# EAGLE schematic whare hauora sensor r1 (EAGLE 7.6.0)
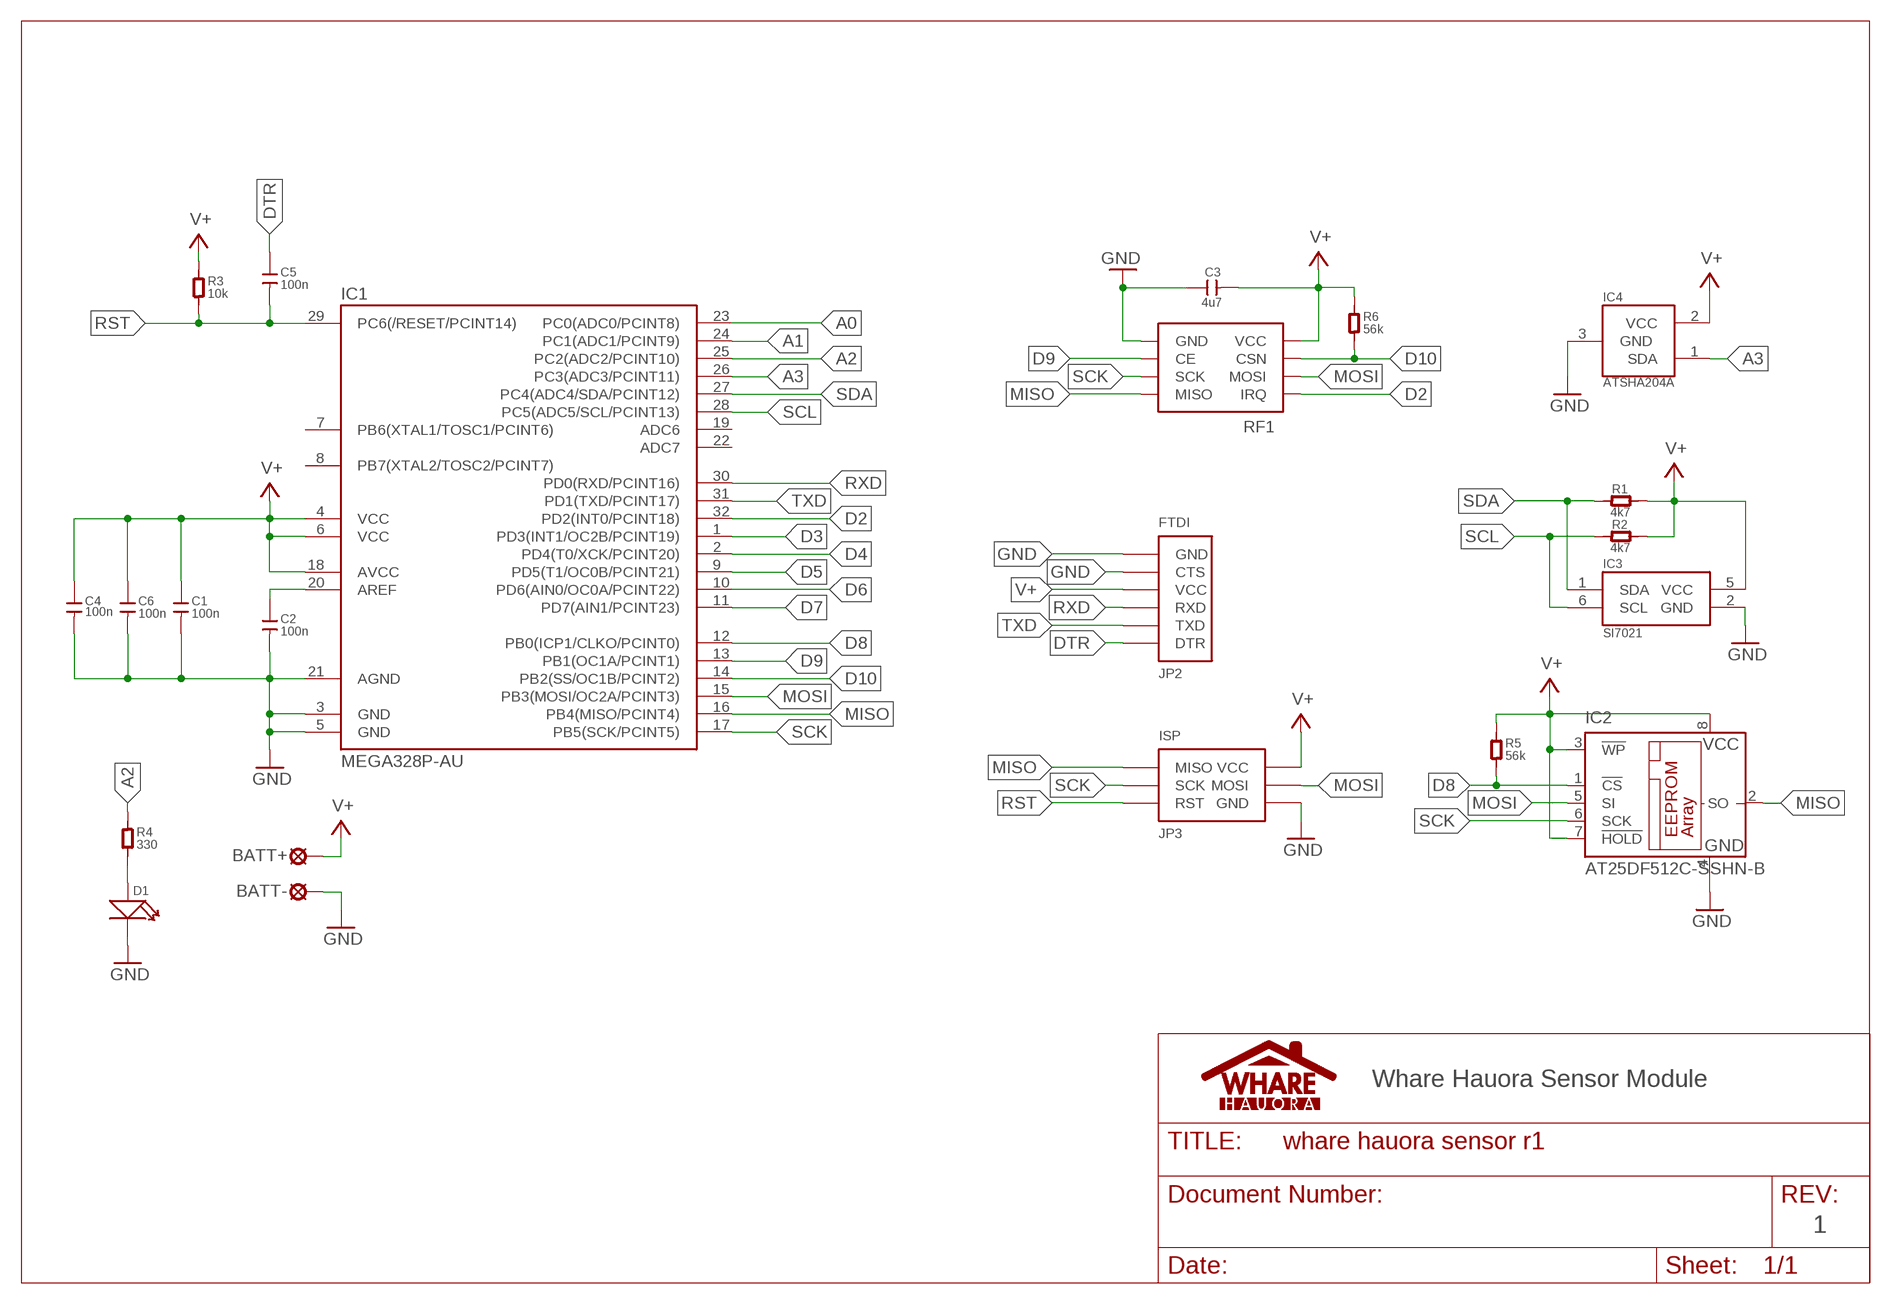
[diagram p0: schematic, sheet 1]

## Parts
BATT+  LSP11  [LSP11]
BATT-  LSP11  [LSP11]
C1  100n  CAP-0603  [C0603]
C2  100n  CAP-0603  [C0603]
C3  4u7  CAP-0603  [C0603]
C4  100n  CAP-0603  [C0603]
C5  100n  CAP-0603  [C0603]
C6  100n  CAP-0603  [C0603]
D1  LED-0603  [LED-0603]
IC1  MEGA328P-AU  MEGA48/88/168-AU  [TQFP32-08]
IC2  AT25DF512C-SSHN-B  25AA080SN  [SO-08]
IC3  SI7021  [DFN6]
IC4  ATSHA204A  [SOT23]
JP2  FTDI  [FTDI]
JP3  ISP  [ISP]
R1  4k7  R-0603  [R0603]
R2  4k7  R-0603  [R0603]
R3  10k  R-0603  [R0603]
R4  330  R-0603  [R0603]
R5  56k  R-0603  [R0603]
R6  56k  R-0603  [R0603]
RF1  NRF24L01+  [NRF24L01+]

## Nets
A0: IC1.23(PC0(ADC0/PCINT8))
A1: IC1.24(PC1(ADC1/PCINT9))
A2: IC1.25(PC2(ADC2/PCINT10)) R4.1
A3: IC1.26(PC3(ADC3/PCINT11)) IC4.1(SDA)
D2: IC1.32(PD2(INT0/PCINT18)) RF1.P$8(IRQ)
D3: IC1.1(PD3(INT1/OC2B/PCINT19))
D4: IC1.2(PD4(T0/XCK/PCINT20))
D5: IC1.9(PD5(T1/OC0B/PCINT21))
D6: IC1.10(PD6(AIN0/OC0A/PCINT22))
D7: IC1.11(PD7(AIN1/PCINT23))
D8: IC1.12(PB0(ICP1/CLKO/PCINT0)) IC2.1(!CS) R5.1
D9: IC1.13(PB1(OC1A/PCINT1)) RF1.P$3(CE)
D10: IC1.14(PB2(SS/OC1B/PCINT2)) R6.1 RF1.P$4(CSN)
DTR: C5.1 JP2.DTR
GND [Power]: BATT-.MP C1.2 C2.2 C3.1 C4.2 C6.2 D1.- IC1.3(GND) IC1.5(GND) IC1.21(AGND) IC2.4(GND) IC3.2(GND) IC4.3(GND) JP2.CTS JP2.GND JP3.GND RF1.P$1(GND)
MISO: IC1.16(PB4(MISO/PCINT4)) IC2.2(SO) JP3.MISO RF1.P$7(MISO)
MOSI: IC1.15(PB3(MOSI/OC2A/PCINT3)) IC2.5(SI) JP3.MOSI RF1.P$6(MOSI)
N$3: D1.+ R4.2
N$4: C2.1 IC1.20(AREF)
RST: C5.2 IC1.29(PC6(/RESET/PCINT14)) JP3.RST R3.1
RXD: IC1.30(PD0(RXD/PCINT16)) JP2.RXD
SCK: IC1.17(PB5(SCK/PCINT5)) IC2.6(SCK) JP3.SCK RF1.P$5(SCK)
SCL: IC1.28(PC5(ADC5/SCL/PCINT13)) IC3.6(SCL) R2.1
SDA: IC1.27(PC4(ADC4/SDA/PCINT12)) IC3.1(SDA) R1.1
TXD: IC1.31(PD1(TXD/PCINT17)) JP2.TXD
V+ [Power]: BATT+.MP C1.1 C3.2 C4.1 C6.1 IC1.4(VCC) IC1.6(VCC) IC1.18(AVCC) IC2.3(!WP) IC2.7(!HOLD) IC2.8(VCC) IC3.5(VCC) IC4.2(VCC) JP2.VCC JP3.VCC R1.2 R2.2 R3.2 R5.2 R6.2 RF1.P$2(VCC)
Unconnected: IC1.7(PB6(XTAL1/TOSC1/PCINT6)) IC1.8(PB7(XTAL2/TOSC2/PCINT7)) IC1.19(ADC6) IC1.22(ADC7)

## Notes on the sheet
- Whare Hauora Sensor Module
- 1

## Library data of the parts
BATT+ BATT- = solpad:LSP11: SOLDER PAD drill 1.1 mm
C1-C6 = Discrete:CAP: Ceramic Capacitors
D1 = Discrete:LED
IC1 = avr-7:MEGA48/88/168
IC2 = microchip:25*: Serial EEPROM 4K/ 8K , SPI bus; MF: MICROCHIP; MPN: 25AA080/SN; OC_FARNELL: 1816072; OC_NEWARK: 92C7351
IC3 = Sensor:SI7021
IC4 = Sensor:ATSHA204A
JP2 = Callum:FTDI: FTDI Programming Header
JP3 = Callum:ISP
R1-R6 = Discrete:R*
RF1 = Callum:NRF24L01+

## Net classes
0 default: width 0.203 mm
1 Power: width 0.406 mm